# EAGLE design infinity (EAGLE 9.2.2)
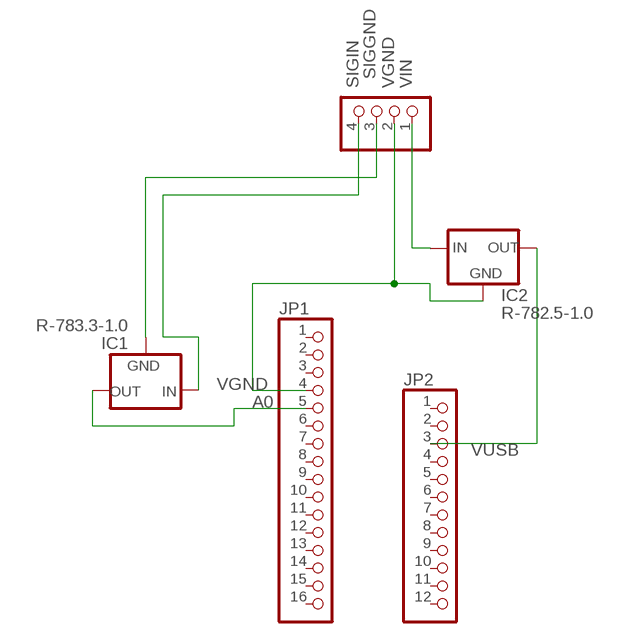
[diagram p0: schematic, sheet 1]

## Parts
IC1  R-783.3-1.0  [SIP3]
IC2  R-782.5-1.0  [SIP3]
JP1  PINHD-1X16  [1X16]
JP2  PINHD-1X12  [1X12]
SIGGND  PINHD-1X4  [1X04]

## Nets
A0: IC1.3(OUT) JP1.5
N$2: IC1.2(GND) SIGGND.3
SIGIN: IC1.1(IN) SIGGND.4
VGND: IC2.2(GND) JP1.4 SIGGND.2
VIN: IC2.1(IN) SIGGND.1
VUSB: IC2.3(OUT) JP2.3
Unconnected: JP1.1 JP1.2 JP1.3 JP1.6 JP1.7 JP1.8 JP1.9 JP1.10 JP1.11 JP1.12 JP1.13 JP1.14 JP1.15 JP1.16 JP2.1 JP2.2 JP2.4 JP2.5 JP2.6 JP2.7 JP2.8 JP2.9 JP2.10 JP2.11 JP2.12

## Library data of the parts
IC1 = r-78xx_10:R-78*-1.0: Innoline R-78xx-1.0 Series Switching Regulators - 1.0A, Standard Source: http://www.recom-international.com/pdf/Innoline/R-78xx-1.0.pdf; MF: Recom; MPN: R-783.3-1.0; OC_FARNELL: 1793141; OC_NEWARK: 62X9540
IC2 = r-78xx_10:R-78*-1.0: Innoline R-78xx-1.0 Series Switching Regulators - 1.0A, Standard Source: http://www.recom-international.com/pdf/Innoline/R-78xx-1.0.pdf; MF: Recom; MPN: R-782.5-1.0; OC_FARNELL: 1793139; OC_NEWARK: 62X9538
JP1 = pinhead:PINHD-1X16: PIN HEADER
JP2 = pinhead:PINHD-1X12: PIN HEADER
SIGGND = pinhead:PINHD-1X4: PIN HEADER

## Board
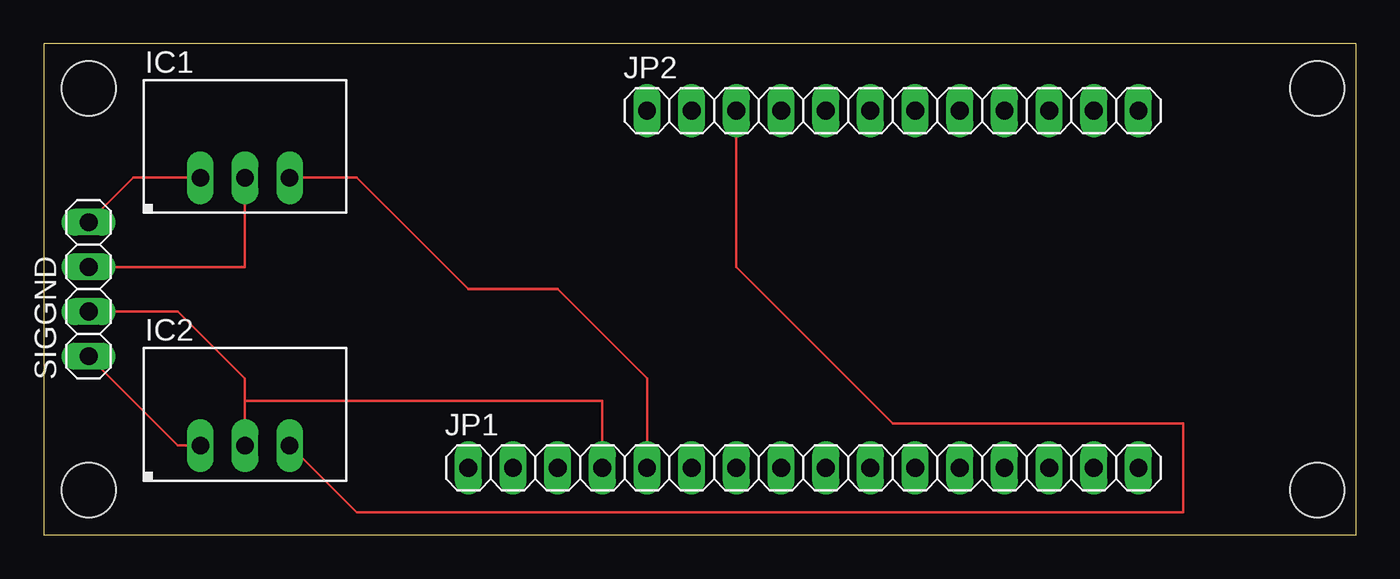
[diagram p1: board, top side]

Size 74.6 x 27.93 mm. Coordinates in mm from the lower left corner, seen from the top.
Outline: 0,0 74.6,0 74.6,27.93 0,27.93 0,0
Copper layers (1*16): Top 0.035mm / dielectric 1.5mm / Bottom 0.035mm
Design rules "default": minimum track width 6mil, minimum drill 0.35mm, track to track 6mil, track to pad 6mil, pad to pad 6mil, via to via 6mil, smd to smd 6mil, copper to edge 40mil, drill to drill 6mil, minimum pad ring 10mil, minimum via ring 8mil, stop-mask expansion 4mil, vias tented up to drill 0mil, thermal gap 10mil
Holes 3.1 mm at 2.54,2.54 2.54,25.4 72.39,25.4 72.39,2.54

### Footprints (pad centres in the part's own frame; a part is rotated, then mirrored left to right if it is on the bottom)
SIP3 = drill 1 long: 1 -2.54,0; 2 0,0; 3 2.54,0
1X16 = drill 1.016 long: 1 -19.05,0; 2 -16.51,0; 3 -13.97,0; 4 -11.43,0; 5 -8.89,0; 6 -6.35,0; 7 -3.81,0; 8 -1.27,0; 9 1.27,0; 10 3.81,0; 11 6.35,0; 12 8.89,0; 13 11.43,0; 14 13.97,0; 15 16.51,0; 16 19.05,0
1X12 = drill 1.016 long: 1 -13.97,0; 2 -11.43,0; 3 -8.89,0; 4 -6.35,0; 5 -3.81,0; 6 -1.27,0; 7 1.27,0; 8 3.81,0; 9 6.35,0; 10 8.89,0; 11 11.43,0; 12 13.97,0
1X04 = drill 1.016 long: 1 -3.81,0; 2 -1.27,0; 3 1.27,0; 4 3.81,0

### Placement (x,y rotation side)
IC1  11.43,20.32 0 top
IC2  11.43,5.08 0 top
JP1  43.18,3.81 0 top
JP2  48.26,24.13 0 top
SIGGND  2.54,13.97 90 top

### Tracks (layer width: path | path; a pad name or v marks a point on that pad's centre or on a via)
A0
  Top 0.152: 34.24,3.91 JP1.5 34.29,8.89 29.21,13.97 24.13,13.97 17.78,20.32 IC1.3
N$2
  Top 0.152: 2.59,15.34 SIGGND.3 11.43,15.24 IC1.2
SIGIN
  Top 0.152: 2.59,17.78 SIGGND.4 5.08,20.32 IC1.1
VGND
  Top 0.152: 2.59,12.6 SIGGND.2 7.62,12.7 11.43,8.89 11.43,7.62 | 11.43,7.62 IC2.2 | JP1.4 31.75,7.62 11.43,7.62
VIN
  Top 0.152: 8.89,5.18 IC2.1 7.62,5.08 SIGGND.1 2.59,10.16
VUSB
  Top 0.152: IC2.3 17.78,1.27 64.77,1.27 64.77,6.35 48.26,6.35 39.37,15.24 JP2.3